# Altium schematic sheet SCH-TR8253.SchDoc
size A4
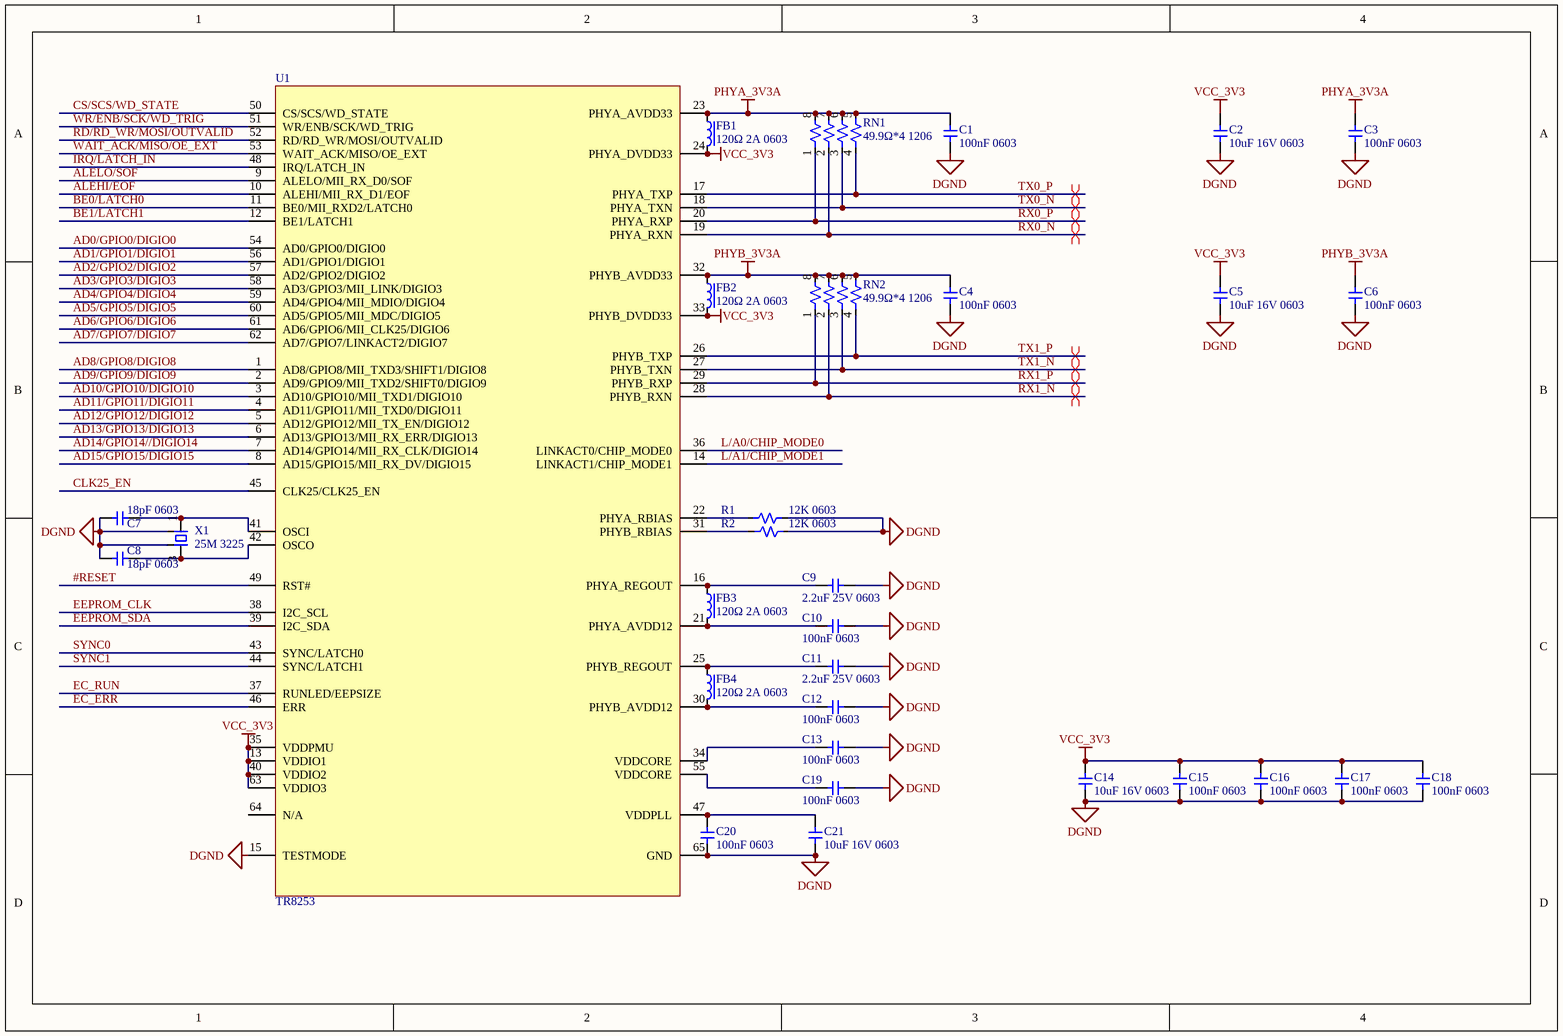
[diagram p0: SCH-TR8253.SchDoc]

## Parts
C1  100nF 0603  [CAPC1608X08 (0603)]
C2  10uF 16V 0603  [CAPC1608X08 (0603)]
C3  100nF 0603  [CAPC1608X08 (0603)]
C4  100nF 0603  [CAPC1608X08 (0603)]
C5  10uF 16V 0603  [CAPC1608X08 (0603)]
C6  100nF 0603  [CAPC1608X08 (0603)]
C7  18pF 0603  [CAPC1608X08 (0603)]
C8  18pF 0603  [CAPC1608X08 (0603)]
C9  2.2uF 25V 0603  [CAPC1608X08 (0603)]
C10  100nF 0603  [CAPC1608X08 (0603)]
C11  2.2uF 25V 0603  [CAPC1608X08 (0603)]
C12  100nF 0603  [CAPC1608X08 (0603)]
C13  100nF 0603  [CAPC1608X08 (0603)]
C14  10uF 16V 0603  [CAPC1608X08 (0603)]
C15  100nF 0603  [CAPC1608X08 (0603)]
C16  100nF 0603  [CAPC1608X08 (0603)]
C17  100nF 0603  [CAPC1608X08 (0603)]
C18  100nF 0603  [CAPC1608X08 (0603)]
C19  100nF 0603  [CAPC1608X08 (0603)]
C20  100nF 0603  [CAPC1608X08 (0603)]
C21  10uF 16V 0603  [CAPC1608X08 (0603)]
FB1  120Ω 2A 0603  [INDC1608X08 (0603)]
FB2  120Ω 2A 0603  [INDC1608X08 (0603)]
FB3  120Ω 2A 0603  [INDC1608X08 (0603)]
FB4  120Ω 2A 0603  [INDC1608X08 (0603)]
R1  12K 0603  [RESC1608X04 (0603)]
R2  12K 0603  [RESC1608X04 (0603)]
RN1  49.9Ω*4 1206  [CAC-80P320X160-8 (1206)]
RN2  49.9Ω*4 1206  [CAC-80P320X160-8 (1206)]
U1  TR8253  [QFN50P900X900X100_HS-65M]
X1  25M 3225  [SON220P250X80-4N-(3225)]

## Nets
DGND: C1.1 C2.2 C3.2 C4.1 C5.2 C6.2 C7.2 C8.2 C9.2 C10.2 C11.2 C12.2 C13.2 C14.1 C15.1 C16.1 C17.1 C18.1 C19.2 C20.2 C21.2 R1.1 R2.2 U1.15(TESTMODE) U1.65(GND) X1.2 X1.4
PHYA_3V3A: C1.2 C3.1 FB1.1 RN1.5 RN1.6 RN1.7 RN1.8 U1.23(PHYA_AVDD33)
PHYB_3V3A: C4.2 C6.1 FB2.1 RN2.5 RN2.6 RN2.7 RN2.8 U1.32(PHYB_AVDD33)
VCC_3V3: C2.1 C5.1 C14.2 C15.2 C16.2 C17.2 C18.2 FB1.2 FB2.2 U1.13(VDDIO1) U1.24(PHYA_DVDD33) U1.33(PHYB_DVDD33) U1.35(VDDPMU) U1.40(VDDIO2) U1.63(VDDIO3)
#RESET: U1.49(RST#)
AD0/GPIO0/DIGIO0: U1.54(AD0/GPIO0/DIGIO0)
AD1/GPIO1/DIGIO1: U1.56(AD1/GPIO1/DIGIO1)
AD2/GPIO2/DIGIO2: U1.57(AD2/GPIO2/DIGIO2)
AD3/GPIO3/DIGIO3: U1.58(AD3/GPIO3/MII_LINK/DIGIO3)
AD4/GPIO4/DIGIO4: U1.59(AD4/GPIO4/MII_MDIO/DIGIO4)
AD5/GPIO5/DIGIO5: U1.60(AD5/GPIO5/MII_MDC/DIGIO5)
AD6/GPIO6/DIGIO6: U1.61(AD6/GPIO6/MII_CLK25/DIGIO6)
AD7/GPIO7/DIGIO7: U1.62(AD7/GPIO7/LINKACT2/DIGIO7)
AD8/GPIO8/DIGIO8: U1.1(AD8/GPIO8/MII_TXD3/SHIFT1/DIGIO8)
AD9/GPIO9/DIGIO9: U1.2(AD9/GPIO9/MII_TXD2/SHIFT0/DIGIO9)
AD10/GPIO10/DIGIO10: U1.3(AD10/GPIO10/MII_TXD1/DIGIO10)
AD11/GPIO11/DIGIO11: U1.4(AD11/GPIO11/MII_TXD0/DIGIO11)
AD12/GPIO12/DIGIO12: U1.5(AD12/GPIO12/MII_TX_EN/DIGIO12)
AD13/GPIO13/DIGIO13: U1.6(AD13/GPIO13/MII_RX_ERR/DIGIO13)
AD14/GPIO14//DIGIO14: U1.7(AD14/GPIO14/MII_RX_CLK/DIGIO14)
AD15/GPIO15/DIGIO15: U1.8(AD15/GPIO15/MII_RX_DV/DIGIO15)
ALEHI/EOF: U1.10(ALEHI/MII_RX_D1/EOF)
ALELO/SOF: U1.9(ALELO/MII_RX_D0/SOF)
BE0/LATCH0: U1.11(BE0/MII_RXD2/LATCH0)
BE1/LATCH1: U1.12(BE1/LATCH1)
CLK25_EN: U1.45(CLK25/CLK25_EN)
CS/SCS/WD_STATE: U1.50(CS/SCS/WD_STATE)
EC_ERR: U1.46(ERR)
EC_RUN: U1.37(RUNLED/EEPSIZE)
EEPROM_CLK: U1.38(I2C_SCL)
EEPROM_SDA: U1.39(I2C_SDA)
IRQ/LATCH_IN: U1.48(IRQ/LATCH_IN)
L/A0/CHIP_MODE0: U1.36(LINKACT0/CHIP_MODE0)
L/A1/CHIP_MODE1: U1.14(LINKACT1/CHIP_MODE1)
RD/RD_WR/MOSI/OUTVALID: U1.52(RD/RD_WR/MOSI/OUTVALID)
RX0_N: RN1.2 U1.19(PHYA_RXN)
RX0_P: RN1.1 U1.20(PHYA_RXP)
RX1_N: RN2.2 U1.28(PHYB_RXN)
RX1_P: RN2.1 U1.29(PHYB_RXP)
SYNC0: U1.43(SYNC/LATCH0)
SYNC1: U1.44(SYNC/LATCH1)
TX0_N: RN1.3 U1.18(PHYA_TXN)
TX0_P: RN1.4 U1.17(PHYA_TXP)
TX1_N: RN2.3 U1.27(PHYB_TXN)
TX1_P: RN2.4 U1.26(PHYB_TXP)
WAIT_ACK/MISO/OE_EXT: U1.53(WAIT_ACK/MISO/OE_EXT)
WR/ENB/SCK/WD_TRIG: U1.51(WR/ENB/SCK/WD_TRIG)
NetC7_1: C7.1 U1.41(OSCI) X1.1
NetC8_1: C8.1 U1.42(OSCO) X1.3
NetC9_1: C9.1 FB3.1 U1.16(PHYA_REGOUT)
NetC10_1: C10.1 FB3.2 U1.21(PHYA_AVDD12)
NetC11_1: C11.1 FB4.1 U1.25(PHYB_REGOUT)
NetC12_1: C12.1 FB4.2 U1.30(PHYB_AVDD12)
NetC13_1: C13.1 U1.34(VDDCORE)
NetC19_1: C19.1 U1.55(VDDCORE)
NetC20_1: C20.1 C21.1 U1.47(VDDPLL)
NetR1_2: R1.2 U1.22(PHYA_RBIAS)
NetR2_1: R2.1 U1.31(PHYB_RBIAS)

Not connected (* = marked no-connect by the designer): U1 64(N/A)

## Layout directives
differential pair: RX0_N, RX0_P, RX1_N, RX1_P, TX0_N, TX0_P, TX1_N, TX1_P

## Library data of the parts
C1 C3 C4 C6 C10 C12 C13 C15-C20 = 100nF 0603: 贴片MLCC电容 100nF 50V X7R 10% 0603; 1st Manufacturer: Yageo; 1st PartNumber: CC0603KRX7R9BB104; 2nd Manufacturer: TDK; 2nd PartNumber: CGA3E2X7R1H104K080AA; ERP_ID: 12A20039
C2 C5 C14 C21 = 10uF 16V 0603: 贴片MLCC电容 10uF 16V X5R 20% 0603; 1st Manufacturer: YAGEO; 1st PartNumber: CC0603KRX5R7BB106; ERP_ID: 12A20110
C7 C8 = 18pF 0603: 贴片MLCC电容 18pF 50V NPO 5% 0603; 1st Manufacturer: Yageo; 1st PartNumber: CC0603JRNPO9BN180; ERP_ID: 12A20092
C9 C11 = 2.2uF 25V 0603: 贴片MLCC电容 2.2uF 25V X5R 10% 0603; 1st Manufacturer: Yageo; 1st PartNumber: CC0603KRX5R8BB225; ERP_ID: 12A20113
FB1-FB4 = 120Ω@100MHz 2A 0603: 电源线磁珠 0603 120Ω@100MHz 2A; 1st PartNumber: PZ1608U121-2R0TF; 1st Manufacturer: 顺络; 2nd Manufacturer: Murata; 2nd PartNumber: BLM18PG121SN1D; ERP_ID: 12A40009
R1 R2 = 12K 0603: 贴片厚膜电阻 12kΩ 1% 0603; 1st Manufacturer: Yageo; 2nd Manufacturer: Bourns; 2nd PartNumber: CR0603-FX-1202ELF; 1st PartNumber: RC0603FR-0712KL; ERP_ID: 12A10055
RN1 RN2 = 49.9Ω*4 1206: 贴片排阻 49.9Ω 5% 4x0603; 1st Manufacturer: Yageo; 2nd Manufacturer: Bourns; 2nd PartNumber: CAY16-49R9F4LF; 1st PartNumber: YC164-FR-0749R9L; ERP_ID: 12A10157
U1 = TR8253: 2/3端口内置以太网PHY的EtherCAT从站控制器; 1st Manufacturer: 创耀; ERP_ID: -; 1st PartNumber: TR8253
X1 = 25M 20ppm 3225: 贴片无源晶振 25MHz 20ppm 12pF; 1st Manufacturer: TXC; 1st PartNumber: 7M-25.000MDHE-T; ERP_ID: 12A50002